# EAGLE design v3smd (EAGLE 7.2.0)
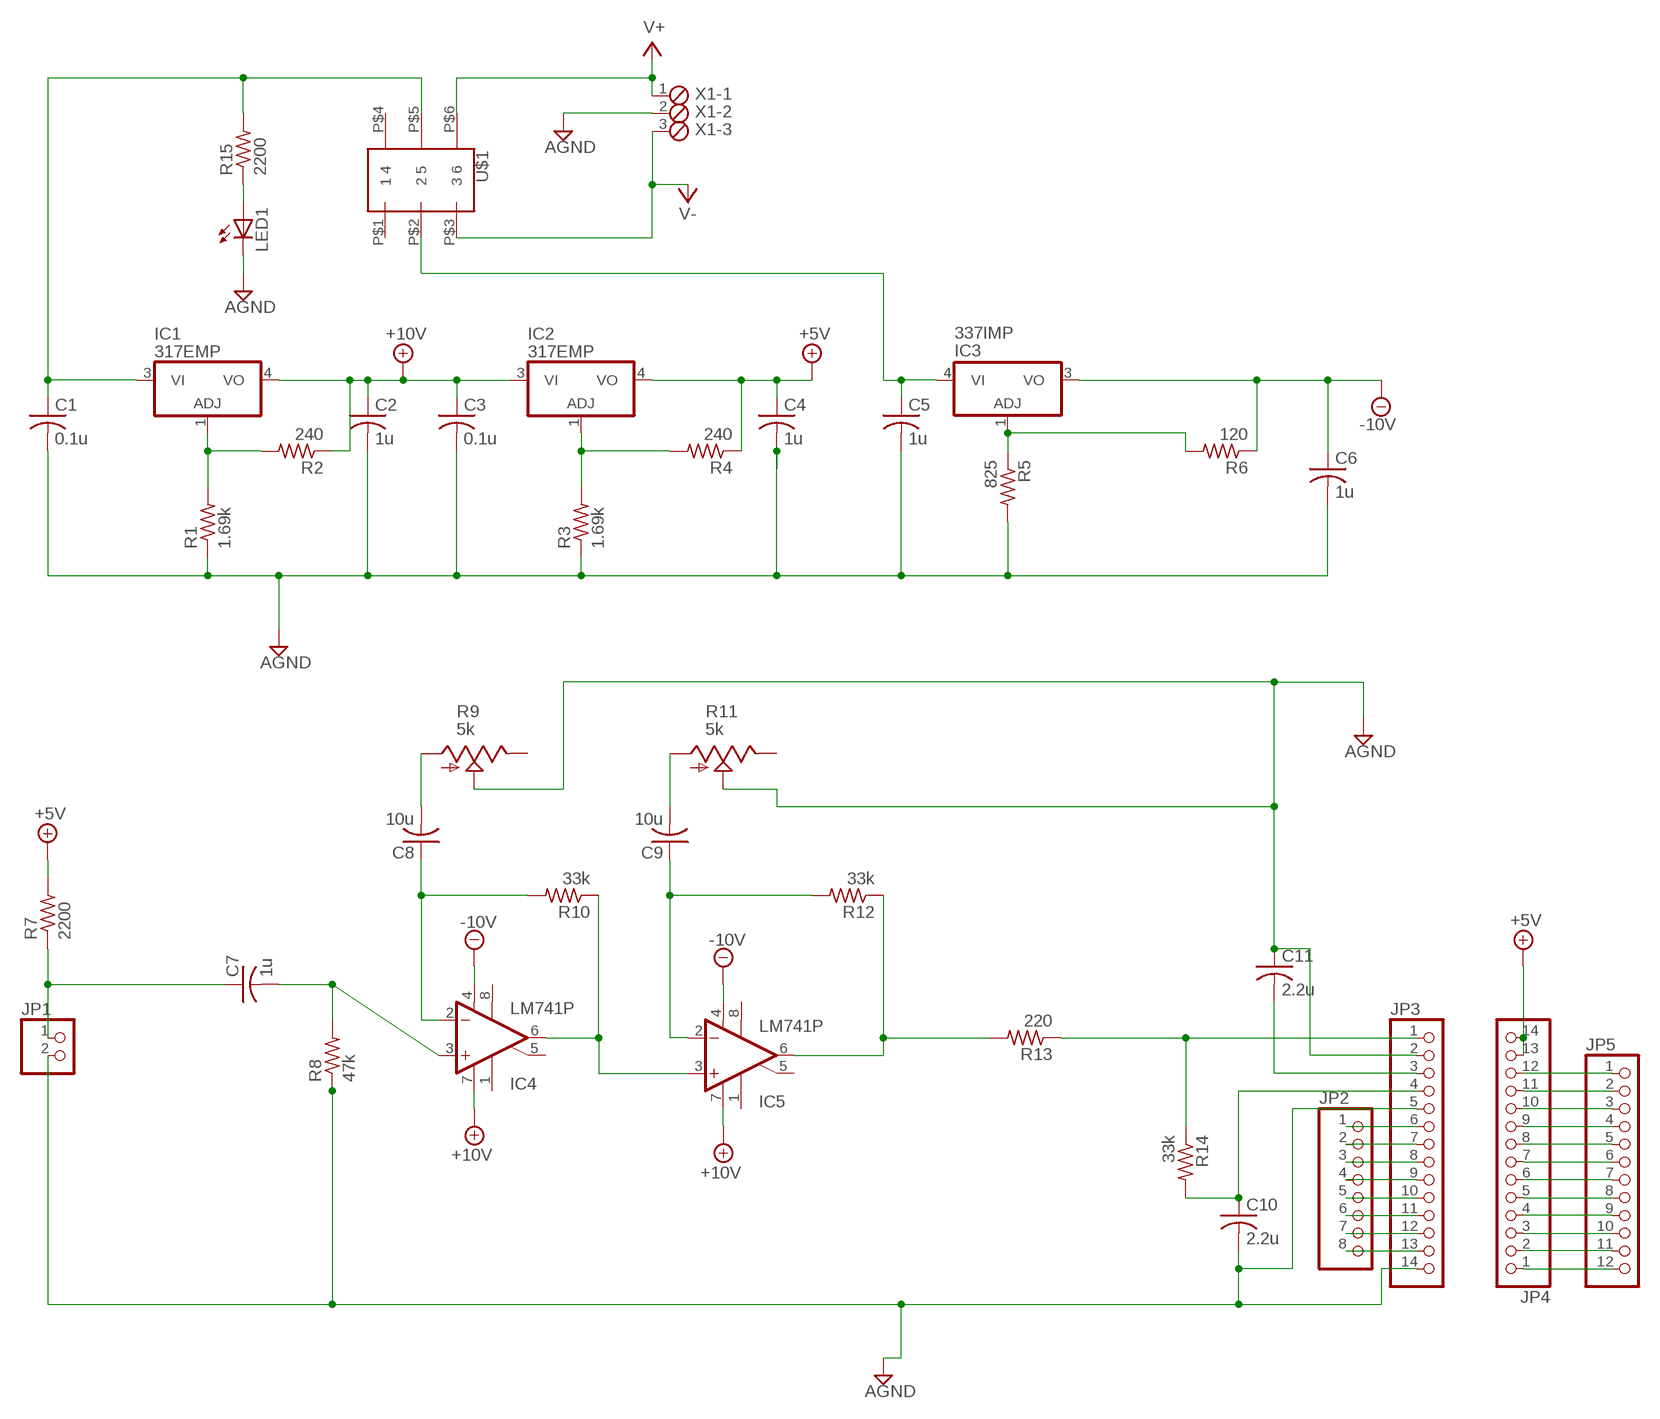
[diagram p0: schematic, sheet 1]

## Parts
C1  0.1u  C-USC1206  [C1206]
C2  1u  C-USC1206  [C1206]
C3  0.1u  C-USC1206  [C1206]
C4  1u  C-USC1206  [C1206]
C5  1u  C-USC1206  [C1206]
C6  1u  C-USC1206  [C1206]
C7  1u  C-USC1206  [C1206]
C8  10u  C-USC1206  [C1206]
C9  10u  C-USC1206  [C1206]
C10  2.2u  C-USC1206  [C1206]
C11  2.2u  C-USC1206  [C1206]
IC1  317EMP  [SOT223]
IC2  317EMP  [SOT223]
IC3  337IMP  [SOT223]
IC4  LM741P  [DIL08]
IC5  LM741P  [DIL08]
JP1  PINHD-1X2  [1X02]
JP2  PINHD-1X8  [1X08]
JP3  PINHD-1X14  [1X14]
JP4  PINHD-1X14  [1X14]
JP5  PINHD-1X12  [1X12]
LED1  LED3MM  [LED3MM]
R1  1.69k  R-US_R2512  [R2512]
R2  240  R-US_R2512  [R2512]
R3  1.69k  R-US_R2512  [R2512]
R4  240  R-US_R2512  [R2512]
R5  825  R-US_R2512  [R2512]
R6  120  R-US_R2512  [R2512]
R7  2200  R-US_R2512  [R2512]
R8  47k  R-US_R2512  [R2512]
R9  5k  TRIM_US-B64Y  [B64Y]
R10  33k  R-US_R2512  [R2512]
R11  5k  TRIM_US-B64Y  [B64Y]
R12  33k  R-US_R2512  [R2512]
R13  220  R-US_R2512  [R2512]
R14  33k  R-US_R2512  [R2512]
R15  2200  R-US_R2512  [R2512]
U$1  S201031MS02Q  [DPST_FOOTPRINT]
X1  MPT3  [3POL254]

## Nets
+5V: C4.1 IC2.4(VO) JP4.13 JP4.14 R4.1 R7.2
+10V: C2.1 C3.1 IC1.4(VO) IC2.3(VI) IC4.7(V+) IC5.7(V+) R2.1
-10V: C6.1 IC3.3(VO) IC4.4(V-) IC5.4(V-) R6.1
AGND: C1.2 C2.2 C3.2 C4.2 C5.2 C6.2 C10.2 C11.1 JP1.2 JP3.2 JP3.5 JP3.14 LED1.K(C) R1.1 R3.1 R5.2 R8.1 R9.S R11.S X1.2
N$1: IC4.6(OUT) IC5.3(+IN) R10.1
N$2: C7.1 JP1.1 R7.1
N$3: C7.2 IC4.3(+IN) R8.2
N$4: C8.1 IC4.2(-IN) R10.2
N$5: IC5.6(OUT) R12.1 R13.2
N$6: C9.1 IC5.2(-IN) R12.2
N$7: JP3.1 R13.1 R14.1
N$8: IC1.1(ADJ) R1.2 R2.2
N$9: IC2.1(ADJ) R3.2 R4.2
N$10: IC3.1(ADJ) R5.1 R6.2
N$11: C8.2 R9.A
N$14: C9.2 R11.A
N$15: C11.2 JP3.3
N$16: C10.1 JP3.4 R14.2
N$18: JP2.8 JP3.13
N$19: JP2.7 JP3.12
N$20: JP2.6 JP3.11
N$21: JP2.5 JP3.10
N$22: JP2.4 JP3.9
N$23: JP2.3 JP3.8
N$24: JP2.2 JP3.7
N$25: JP2.1 JP3.6
N$26: JP4.1 JP5.12
N$27: JP4.2 JP5.11
N$28: JP4.3 JP5.10
N$29: JP4.4 JP5.9
N$30: JP4.5 JP5.8
N$31: JP4.6 JP5.7
N$32: JP4.7 JP5.6
N$33: JP4.8 JP5.5
N$34: JP4.9 JP5.4
N$35: JP4.10 JP5.3
N$36: JP4.11 JP5.2
N$37: JP4.12 JP5.1
N$43: C1.1 IC1.3(VI) R15.2 U$1.P$5
N$44: C5.1 IC3.4(VI) U$1.P$2
N$45: LED1.A R15.1
V+: U$1.P$6 X1.1
V-: U$1.P$3 X1.3
Unconnected: IC4.1(ON1) IC4.5(ON2) IC4.8(OPT) IC5.1(ON1) IC5.5(ON2) IC5.8(OPT) R9.E R11.E U$1.P$1 U$1.P$4

## Library data of the parts
C1-C11 = rcl:C-US: CAPACITOR, American symbol
IC1 IC2 = linear:*317: Positive VOLTAGE REGULATOR
IC3 = linear:*337: Negative VOLTAGE REGULATOR
IC4 IC5 = linear:*741: OP AMP
JP1 = pinhead:PINHD-1X2: PIN HEADER
JP2 = pinhead:PINHD-1X8: PIN HEADER
JP3 JP4 = pinhead:PINHD-1X14: PIN HEADER
JP5 = pinhead:PINHD-1X12: PIN HEADER
LED1 = led:LED: LED OSRAM: - CHIPLED LG R971, LG N971, LY N971, LG Q971, LY Q971, LO R971, LY R971 LH N974, LH R974 LS Q976, LO Q976, LY Q976 LO Q996 - Hyper CHIPLED LW Q18S LB Q993, LB Q99A, LB R99A - SideLED LS A670, LO A670, LY A670, LG A670, LP A670 LB A673, LV A673, LT A673, LW A673 LH A674 LY A675 LS A676, LA A676, LO A676, LY A676, LW A676 LS A679, LY A679, LG A679 - Hyper Micro SIDELED® LS Y876, LA Y876, LO Y876, LY Y876 LT Y87S - SmartLED LW L88C, LW L88S LB L89C, LB L89S, LG L890 LS L89K, LO L89K, LY L89K LS L896, LA L896, LO L896, LY L896 - TOPLED LS T670, LO T670, LY T670, LG T670, LP T670 LSG T670, LSP T670, LSY T670, LOP T670, LYG T670 LG T671, LOG T671, LSG T671 LB T673, LV T673, LT T673, LW T673 LH T674 LS T676, LA T676, LO T676, LY T676, LB T676, LH T676, LSB T676, LW T676 LB T67C, LV T67C, LT T67C, LS T67K, LO T67K, LY T67K, LW E67C LS E67B, LA E67B, LO E67B, LY E67B, LB E67C, LV E67C, LT E67C LW T67C LS T679, LY T679, LG T679 LS T770, LO T770, LY T770, LG T770, LP T770 LB T773, LV T773, LT T773, LW T773 LH T774 LS E675, LA E675, LY E675, LS T675 LS T776, LA T776, LO T776, LY T776, LB T776 LHGB T686 LT T68C, LB T68C - Hyper Mini TOPLED® LB M676 - Mini TOPLED Santana® LG M470 LS M47K, LO M47K, LY M47K Source: http://www.osram.convergy.de LUXEON: - LUMILED® LXK2-PW12-R00, LXK2-PW12-S00, LXK2-PW14-U00, LXK2-PW14-V00 LXK2-PM12-R00, LXK2-PM12-S00, LXK2-PM14-U00 LXK2-PE12-Q00, LXK2-PE12-R00, LXK2-PE12-S00, LXK2-PE14-T00, LXK2-PE14-U00 LXK2-PB12-K00, LXK2-PB12-L00, LXK2-PB12-M00, LXK2-PB14-N00, LXK2-PB14-P00, LXK2-PB14-Q00 LXK2-PR12-L00, LXK2-PR12-M00, LXK2-PR14-Q00, LXK2-PR14-R00 LXK2-PD12-Q00, LXK2-PD12-R00, LXK2-PD12-S00 LXK2-PH12-R00, LXK2-PH12-S00 LXK2-PL12-P00, LXK2-PL12-Q00, LXK2-PL12-R00 Source: www.luxeon.com KINGBRIGHT: KA-3528ASYC Source: www.kingbright.com
R1-R8 R10 R12-R15 = rcl:R-US_: RESISTOR, American symbol
R9 R11 = pot:TRIM_US-: POTENTIOMETER
U$1 = mylib:S201031MS02Q
X1 = con-phoenix-254:MPT3: PHOENIX CONNECTOR; OC_FARNELL: unknown; OC_NEWARK: unknown

## Net classes
0 default: clearance 0.205 mm

## Board
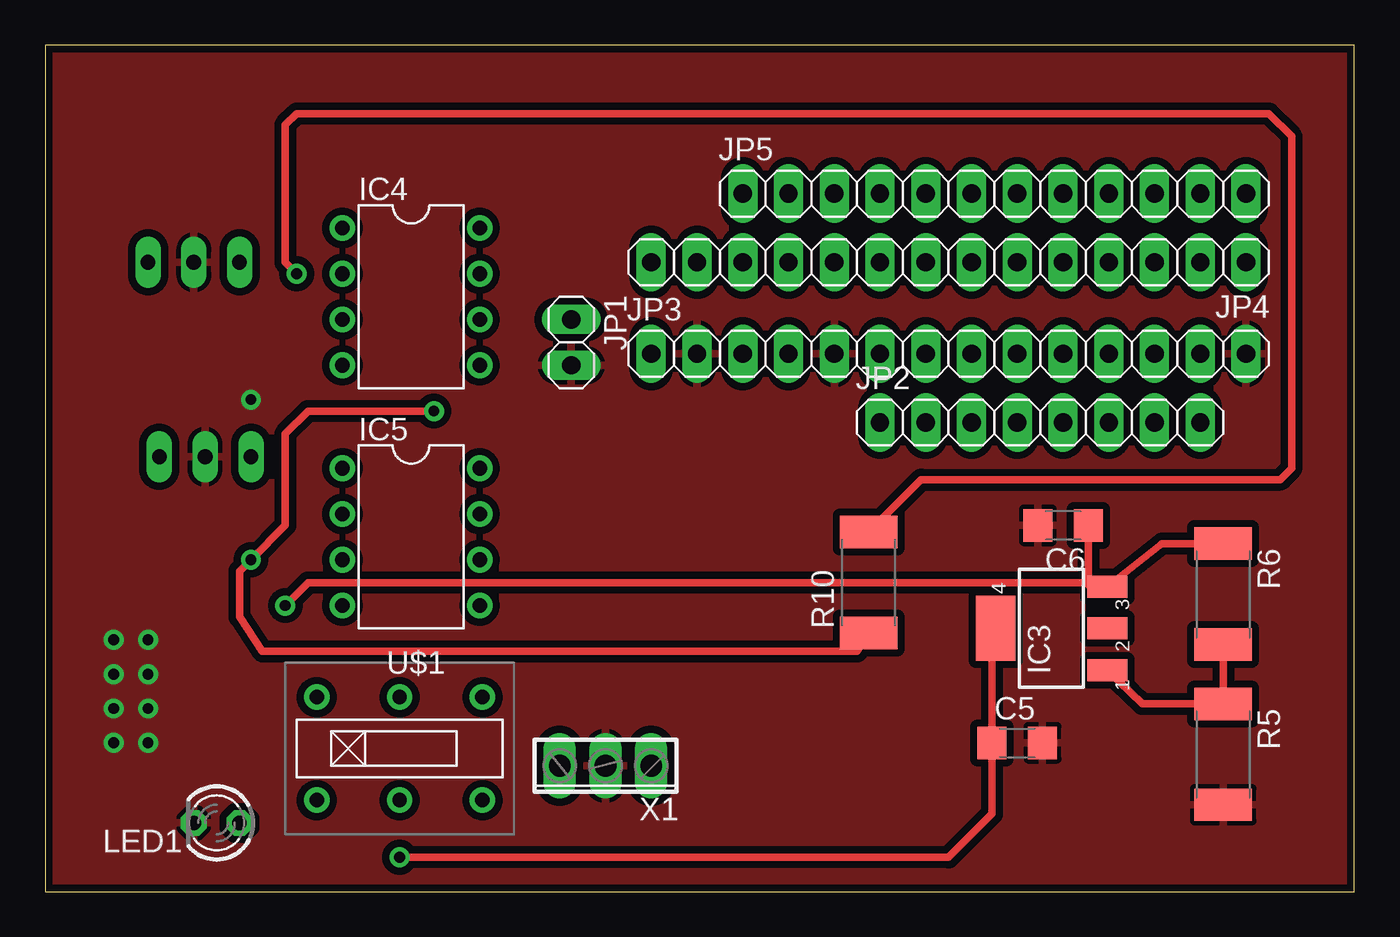
[diagram p1: board, top side]
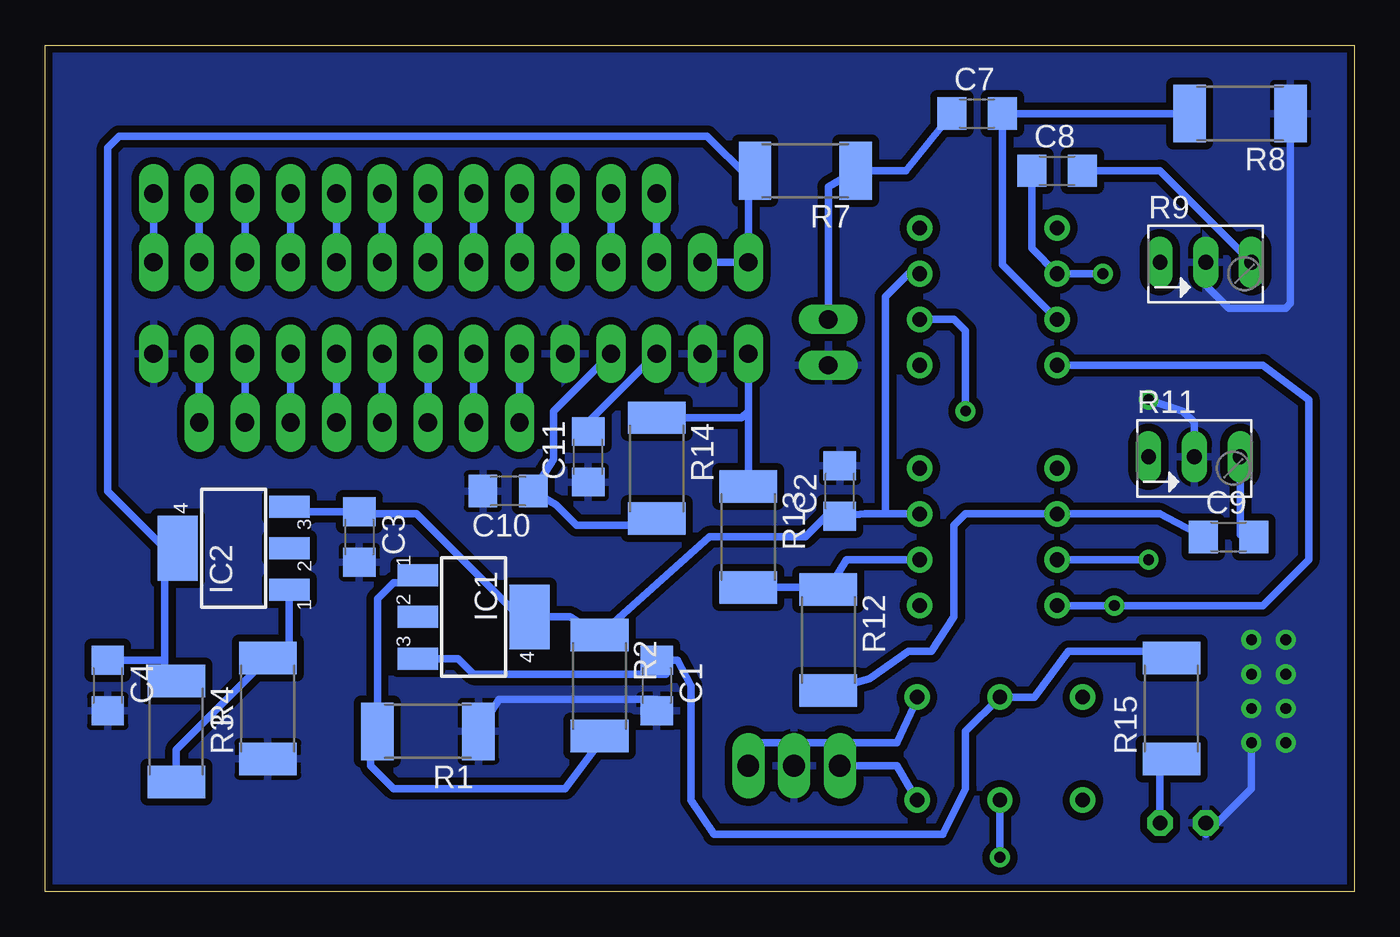
[diagram p2: board, bottom side, seen from below]

Size 72.69 x 46.98 mm. Coordinates in mm from the lower left corner, seen from the top.
Outline: 0,0 72.69,0 72.69,46.98 0,46.98 0,0
Copper layers (1*16): Top 0.035mm / dielectric 1.5mm / Bottom 0.035mm
Design rules "SparkFun": minimum track width 8mil, minimum drill 20mil, track to track 8mil, track to pad 8mil, pad to pad 8mil, via to via 8mil, smd to smd 8mil, copper to edge 10mil, drill to drill 8mil, minimum pad ring 12mil, minimum via ring 10mil, stop-mask expansion 4mil, vias tented up to drill 25mil, thermal gap 10mil

### Footprints (pad centres in the part's own frame; a part is rotated, then mirrored left to right if it is on the bottom)
C1206 = smd 1.6 x 1.8: 1 -1.4,0; 2 1.4,0
SOT223 = smd 1.219 x 2.235: 1 -2.311,-3.099; 2 0,-3.099; 3 2.311,-3.099 | smd 3.6 x 2.2: 4 0,3.099
DIL08 = drill 0.813 pad 1.27: 1 -3.81,-3.81; 2 -1.27,-3.81; 3 1.27,-3.81; 4 3.81,-3.81; 5 3.81,3.81; 6 1.27,3.81; 7 -1.27,3.81; 8 -3.81,3.81
1X02 = drill 1.016 long: 1 -1.27,0; 2 1.27,0
1X08 = drill 1.016 long: 1 -8.89,0; 2 -6.35,0; 3 -3.81,0; 4 -1.27,0; 5 1.27,0; 6 3.81,0; 7 6.35,0; 8 8.89,0
1X14 = drill 1.016 long: 1 -16.51,0; 2 -13.97,0; 3 -11.43,0; 4 -8.89,0; 5 -6.35,0; 6 -3.81,0; 7 -1.27,0; 8 1.27,0; 9 3.81,0; 10 6.35,0; 11 8.89,0; 12 11.43,0; 13 13.97,0; 14 16.51,0
1X12 = drill 1.016 long: 1 -13.97,0; 2 -11.43,0; 3 -8.89,0; 4 -6.35,0; 5 -3.81,0; 6 -1.27,0; 7 1.27,0; 8 3.81,0; 9 6.35,0; 10 8.89,0; 11 11.43,0; 12 13.97,0
LED3MM = drill 0.813 octagon: A -1.27,0; K 1.27,0
R2512 = smd 1.8 x 3.2: 1 -2.8,0; 2 2.8,0
B64Y = drill 0.813 long: A 2.54,0; E -2.54,0; S 0,0
DPST_FOOTPRINT = drill 0.8: P$1 4.597,5.715; P$2 0,5.715; P$3 -4.597,5.715; P$4 4.597,0; P$5 0,0; P$6 -4.597,0
3POL254 = drill 1.2 long: 1 -2.54,0; 2 0,0; 3 2.54,0

### Placement (x,y rotation side)
C1  38.73,11.43 270 bottom
C2  28.57,22.23 90 bottom
C3  55.24,19.69 270 bottom
C4  69.22,11.43 270 bottom
C5  53.97,8.26 0 top
C6  56.52,20.32 180 top
C7  20.96,43.18 0 bottom
C8  16.51,40 0 bottom
C9  6.98,19.69 0 bottom
C10  46.99,22.23 180 bottom
C11  42.54,24.13 90 bottom
IC1  48.89,15.24 270 bottom
IC2  62.23,19.05 90 bottom
IC3  55.88,14.61 90 top
IC4  20.32,33.02 270 top
IC5  20.32,19.69 270 top
JP1  29.21,30.48 270 top
JP2  55.24,26.04 0 top
JP3  50.16,29.85 0 top
JP4  50.16,34.92 180 top
JP5  52.7,38.73 0 top
LED1  9.53,3.81 180 top
R1  51.43,8.89 180 bottom
R2  41.91,11.43 270 bottom
R3  60.33,10.16 90 bottom
R4  65.41,8.89 270 bottom
R5  65.41,7.62 270 top
R6  65.41,16.51 270 top
R7  30.48,40 180 bottom
R8  6.35,43.18 180 bottom
R9  8.25,34.92 0 bottom
R10  45.72,17.15 90 top
R11  8.89,24.13 0 bottom
R12  29.21,13.97 270 bottom
R13  33.66,19.69 270 bottom
R14  38.73,23.5 270 bottom
R15  10.16,10.16 90 bottom
U$1  19.69,10.79 180 top
X1  31.11,6.98 180 top

### Tracks (layer width: path | path; a pad name or v marks a point on that pad's centre or on a via)
+5V
  Bottom 0.406: JP4.13 JP4.14 33.66,39.63 | R7.2 33.66,39.63 | IC2.4 66.04,19.05 | 66.04,19.05 69.22,22.23 69.22,41.27 68.58,41.91 35.93,41.91 33.66,39.63 | 66.04,19.05 66.04,12.7 | 66.04,12.7 66.04,12.32 R4.1 | C4.1 66.17,12.83 66.04,12.7
+10V
  Bottom 0.406: IC2.3 58.85,21.09 C3.1 55.11,20.96 52.07,20.96 46.35,15.24 IC1.4 43.55,15.24 R2.1 35.82,19.69 30.48,19.69 29.34,20.83 C2.1 27.18,20.96 26.04,20.96 | 26.04,20.96 IC5.7 | IC4.7 24.77,34.29 26.04,33.02 26.04,20.96
-10V  (via drill 0.6)
  Top 0.406: R6.1 62.01,19.31 IC3.3 | IC3.3 58.75,17.15 14.6,17.15 v13.33,15.88 | C6.1 57.91,17.02 58.42,16.51 58.57,16.51 IC3.3
  Bottom 0.406: IC4.4 5.08,29.21 2.54,27.31 2.54,18.42 5.08,15.88 IC5.4 v13.33,15.88
AGND  (via drill 0.6)
  Bottom 0.406: R1.1 47.49,10.66 38.73,10.66 C1.2 | R8.1 3.55,32.64 3.81,32.38 6.98,32.38 8.25,33.66 R9.S | R11.S 8.89,26.04 9.53,26.67 v11.43,27.31 | LED1.K 8.25,3.17 5.71,5.71 v5.71,8.26
  other vias: 3.81,13.97 5.71,10.16 3.81,8.26 3.81,10.16 3.81,12.06 5.71,12.06 5.71,13.97
  pour Top (isolate 0.406): 0,0 0,46.99 73.02,46.99 73.02,0
  pour Bottom (isolate 0.406): 0,0 0,46.99 73.02,46.99 73.02,0
N$1  (via drill 0.6)
  Top 0.406: R10.1 45.09,13.33 12.06,13.33 10.79,15.24 10.79,17.78 v11.43,18.42 13.33,20.32 13.33,25.4 14.6,26.67 v21.59,26.67
  Bottom 0.406: IC4.6 22.23,31.75 21.59,31.12 v21.59,26.67 | v11.43,18.42 IC5.3
N$2
  Bottom 0.406: C7.1 24.89,40 R7.1 29.21,39.11 JP1.1
N$3
  Bottom 0.406: R8.2 C7.2 19.55,34.79 IC4.3
N$4  (via drill 0.6)
  Top 0.406: v13.97,34.29 13.33,34.92 13.33,42.54 13.97,43.18 67.94,43.18 69.22,41.91 69.22,23.5 68.58,22.86 48.63,22.86 R10.2
  Bottom 0.406: C8.1 17.91,35.69 IC4.2 v13.97,34.29
N$5
  Bottom 0.406: IC5.6 28.2,18.42 R12.1 29.73,16.89 R13.2
N$6
  Bottom 0.406: R12.2 26.93,11.8 24.77,13.33 23.5,13.33 22.23,15.24 22.23,20.32 21.59,20.96 IC5.2 10.79,20.96 C9.1
N$7
  Bottom 0.406: JP3.1 33.66,26.67 | 33.66,26.67 R13.1 | R14.1 34.03,26.3 33.66,26.67
N$8
  Bottom 0.406: R2.2 41.91,8.26 43.81,5.71 53.34,5.71 54.61,6.98 54.61,8.52 R1.2 54.23,16.25 53.34,17.15 52.4,17.15 IC1.1
N$9
  Bottom 0.406: IC2.1 59.13,13.67 R3.2 65.41,7.88 R4.2
N$10
  Top 0.406: R6.2 R5.1 60.91,10.42 IC3.1
N$11
  Bottom 0.406: C8.2 10.79,40 R9.A
N$14
  Bottom 0.406: R11.A 6.35,19.82 C9.2
N$15
  Bottom 0.406: JP3.3 42.54,26.04 C11.2
N$16
  Bottom 0.406: R14.2 39.11,20.32 43.18,20.32 44.32,21.46 C10.1 44.45,24 44.45,26.67 JP3.4
N$18
  Bottom 0.406: JP3.13 JP2.8
N$19
  Bottom 0.406: JP3.12 JP2.7
N$20
  Bottom 0.406: JP3.11 JP2.6
N$21
  Bottom 0.406: JP3.10 JP2.5
N$22
  Bottom 0.406: JP3.9 JP2.4
N$23
  Bottom 0.406: JP3.8 JP2.3
N$24
  Bottom 0.406: JP3.7 JP2.2
N$25
  Bottom 0.406: JP3.6 JP2.1
N$26
  Bottom 0.406: JP5.12 JP4.1
N$27
  Bottom 0.406: JP5.11 JP4.2
N$28
  Bottom 0.406: JP5.10 JP4.3
N$29
  Bottom 0.406: JP5.9 JP4.4
N$30
  Bottom 0.406: JP5.8 JP4.5
N$31
  Bottom 0.406: JP5.7 JP4.6
N$32
  Bottom 0.406: JP5.6 JP4.7
N$33
  Bottom 0.406: JP5.5 JP4.8
N$34
  Bottom 0.406: JP5.4 JP4.9
N$35
  Bottom 0.406: JP5.3 JP4.10
N$36
  Bottom 0.406: JP5.2 JP4.11
N$37
  Bottom 0.406: JP5.1 JP4.12
N$43
  Bottom 0.406: IC1.3 49.76,12.93 48.89,12.06 38.23,12.06 C1.1 37.59,12.83 36.83,11.43 36.83,5.08 35.56,3.17 22.86,3.17 21.59,5.71 21.59,8.89 U$1.P$5 17.78,10.79 15.87,13.33 10.42,13.33 R15.2
N$44  (via drill 0.6)
  Top 0.406: IC3.4 52.57,14.61 C5.1 52.57,4.32 50.16,1.91 v19.69,1.91
  Bottom 0.406: U$1.P$2 v19.69,1.91
N$45
  Bottom 0.406: LED1.A 10.79,7.36 R15.1
V+
  Bottom 0.406: U$1.P$6 24.28,10.64 25.4,8.26 33.02,8.26 X1.1
V-
  Bottom 0.406: U$1.P$3 25.4,6.98 X1.3